# EAGLE design Enclosure 85x58 PBIU (EAGLE 9.6.1)
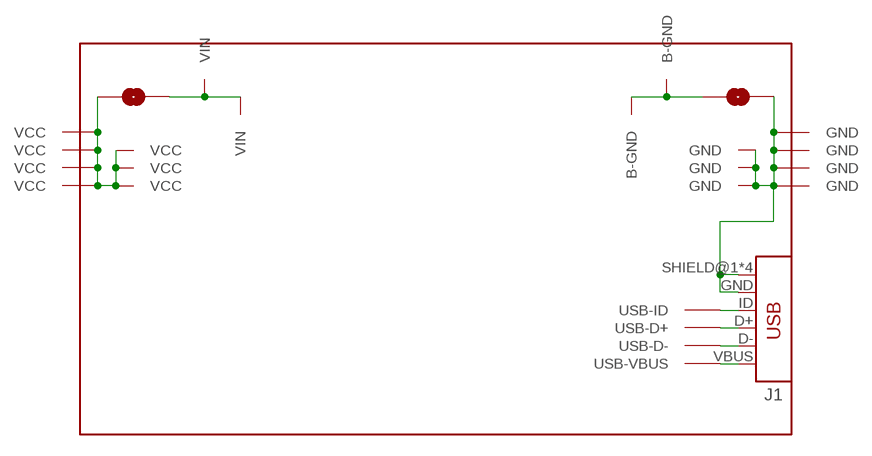
[diagram p0: schematic, sheet 1]

## Parts
J1  USB_MINI-B_SMT  [USB-MINIB]
U$1  PROTO-28X18-BAT-USB-SJ  [PROTO-28X18-BAT-USB-SJ]

## Nets
GND: J1.GND J1.SHIELD@1(SHIELD) J1.SHIELD@2(SHIELD) J1.SHIELD@3(SHIELD) J1.SHIELD@4(SHIELD) U$1.GND U$1.P27-11(GND) U$1.P27-12(GND) U$1.P27-13(GND) U$1.P28-11(GND) U$1.P28-12(GND) U$1.P28-13(GND) U$1.P28-14(GND)
N$2: U$1.P02-14(VIN) U$1.P03-14(VIN) U$1.VIN
N$3: U$1.B-GND U$1.P25-14(B-GND) U$1.P27-14(B-GND)
N$5: J1.VBUS U$1.P25-04(USB-VBUS)
N$6: J1.D- U$1.P25-05(USB-D-)
N$7: J1.D+ U$1.P25-06(USB-D+)
N$8: J1.ID U$1.P25-07(USB-ID)
VCC: U$1.P01-11(VCC) U$1.P01-12(VCC) U$1.P01-13(VCC) U$1.P01-14(VCC) U$1.P02-11(VCC) U$1.P02-12(VCC) U$1.P02-13(VCC) U$1.VCC

## Library data of the parts
J1 = digitalconcepts:USB_MINI-B: USB Mini-B Connector Breaks out 5 pins, and includes shield pins if needed.
U$1 = digitalconcepts:PROTO-28X18-BAT-USB-SJ: 28 x 18 Prototyping board, with SJ between battery connections and GND/Vcc planes and coupled side connection points, to fit an 85 x 58 enclosure

## Board
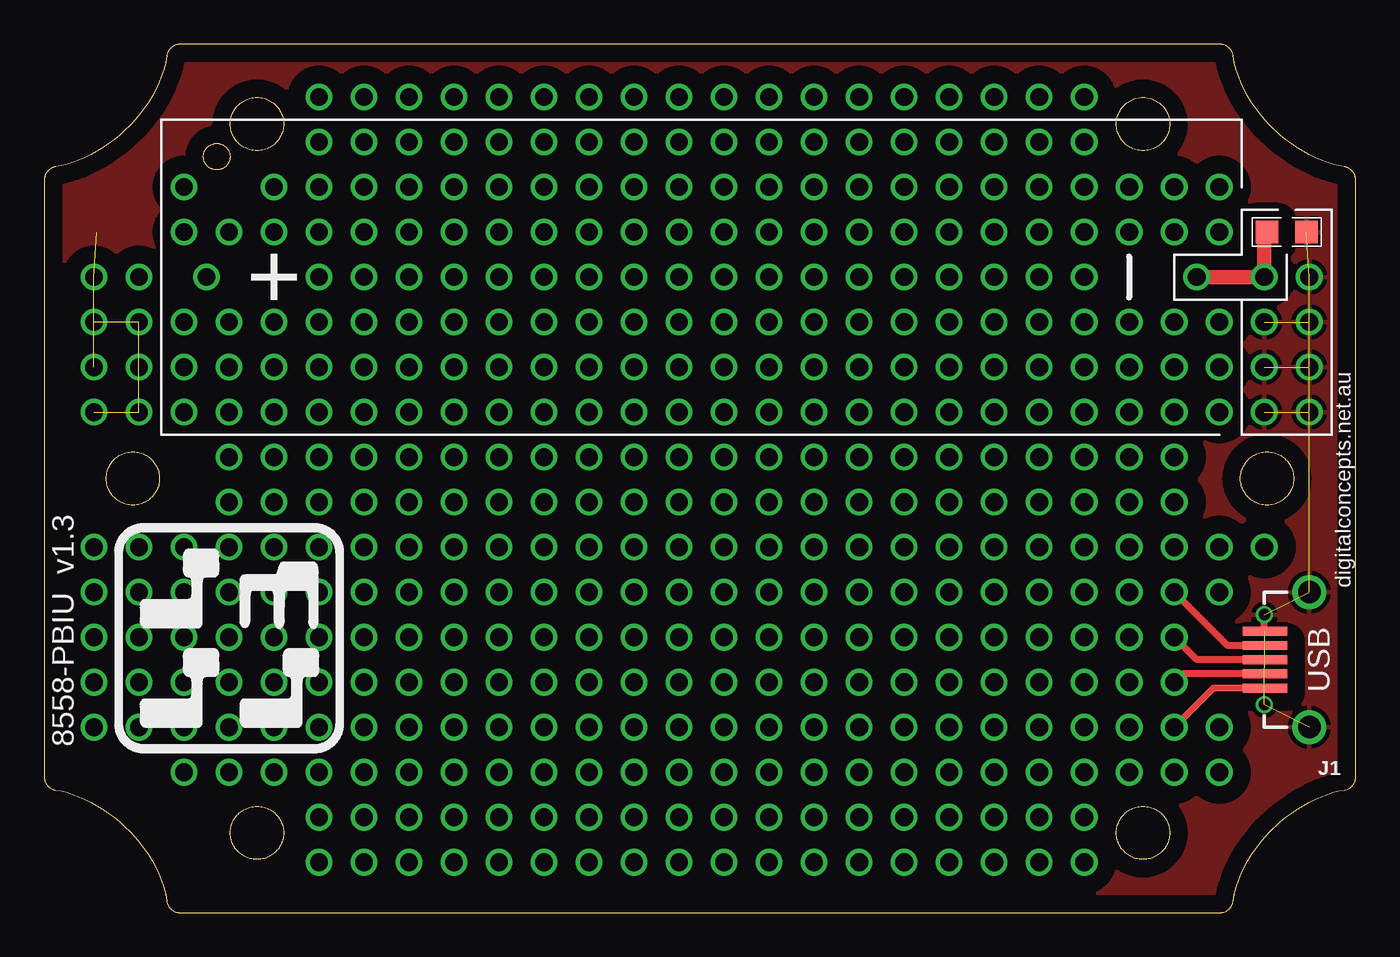
[diagram p1: board, top side]
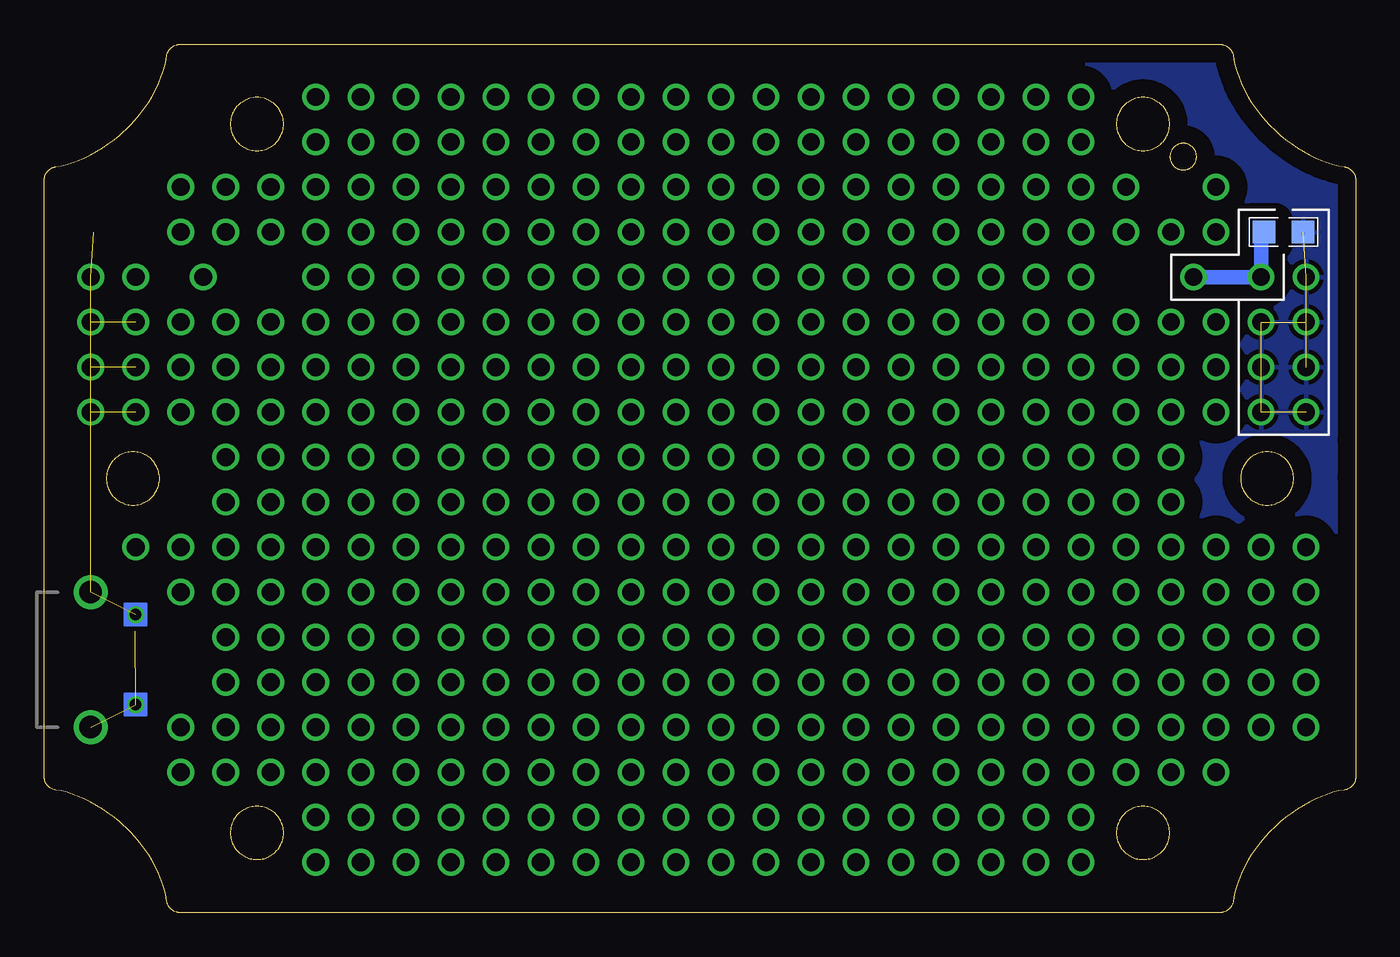
[diagram p2: board, bottom side, seen from below]

Size 74 x 49 mm. Coordinates in mm from the lower left corner, seen from the top.
Outline: 7.52,48.99 7.48,48.98 7.43,48.97 7.39,48.95 7.35,48.94 7.31,48.92 7.27,48.89 7.24,48.87 7.2,48.85 7.17,48.82 7.13,48.79 7.1,48.76 7.08,48.73 7.05,48.69 7.02,48.66 7,48.62 6.98,48.58 6.96,48.54 6.95,48.5 6.93,48.46 6.92,48.41 6.92,48.37 6.85,47.96 6.75,47.57 6.61,47.18 6.47,46.8 6.29,46.43 6.09,46.08 5.88,45.72 5.65,45.38 5.39,45.06 5.13,44.74 4.85,44.44 4.55,44.16 4.26,43.88 3.94,43.62 3.62,43.39 3.3,43.16 2.96,42.95 2.63,42.78 2.29,42.6 1.96,42.45 1.62,42.33 1.29,42.22 0.96,42.13 0.64,42.09 0.59,42.08 0.55,42.07 0.51,42.05 0.47,42.04 0.43,42.02 0.39,42 0.35,41.98 0.31,41.96 0.28,41.93 0.25,41.9 0.22,41.87 0.16,41.81 0.13,41.77 0.11,41.73 0.09,41.7 0.07,41.66 0.05,41.61 0.03,41.57 0.02,41.53 0.01,41.48 0,41.44 0,41.39 0,41.34 0,41.33 0,26.66 0,24.57 0,7.61 0,7.56 0.01,7.52 0.02,7.47 0.03,7.43 0.05,7.39 0.07,7.34 0.09,7.31 0.11,7.27 0.13,7.23 0.16,7.19 0.19,7.16 0.22,7.13 0.25,7.1 0.28,7.07 0.31,7.04 0.35,7.02 0.43,6.98 0.47,6.96 0.51,6.95 0.55,6.93 0.59,6.92 0.64,6.91 0.96,6.87 1.29,6.78 1.62,6.67 1.96,6.55 2.29,6.4 2.63,6.22 2.96,6.05 3.3,5.84 3.62,5.61 3.94,5.38 4.26,5.12 4.55,4.84 4.85,4.56 5.13,4.26 5.39,3.94 5.65,3.62 5.88,3.28 6.09,2.92 6.29,2.57 6.47,2.2 6.61,1.82 6.75,1.43 6.85,1.04 6.92,0.63 6.92,0.59 6.93,0.54 6.95,0.5 6.96,0.46 6.98,0.42 7,0.38 7.02,0.34 7.05,0.31 7.08,0.28 7.1,0.24 7.13,0.21 7.17,0.18 7.2,0.15 7.24,0.13 7.27,0.11 7.31,0.08 7.35,0.06 7.39,0.05 7.43,0.03 7.48,0.02 7.52,0.01 7.56,0 7.61,0 66.39,0 66.43,0 66.48,0.01 66.52,0.02 66.57,0.03 66.65,0.06 66.69,0.08 66.73,0.11 66.76,0.13 66.8,0.15 66.87,0.21 66.9,0.24 66.92,0.28 66.95,0.31 66.98,0.34 67.02,0.42 67.04,0.46 67.05,0.5 67.07,0.54 67.08,0.59 67.08,0.63 67.14,1.04 67.25,1.43 67.39,1.82 67.53,2.2 67.71,2.57 67.91,2.92 68.12,3.28 68.35,3.62 68.61,3.94 68.87,4.26 69.15,4.56 69.74,5.12 70.06,5.38 70.38,5.61 70.7,5.84 71.03,6.05 71.37,6.22 71.71,6.4 72.04,6.55 72.38,6.67 72.71,6.78 73.04,6.87 73.36,6.91 73.41,6.92 73.45,6.93 73.53,6.96 73.57,6.98 73.65,7.02 73.68,7.04 73.72,7.07 73.75,7.1 73.78,7.13 73.81,7.16 73.84,7.19 73.87,7.23 73.89,7.27 73.91,7.31 73.93,7.34 73.95,7.39 73.97,7.43 73.98,7.47 73.99,7.52 73.99,7.56 74,7.61 74,14.51 74,16.35 74,24.49 74,26.59 74,41.39 74,41.44 73.99,41.48 73.98,41.53 73.97,41.57 73.95,41.61 73.93,41.66 73.91,41.7 73.89,41.73 73.87,41.77 73.84,41.81 73.81,41.84 73.78,41.87 73.75,41.9 73.72,41.93 73.69,41.96 73.65,41.98 73.61,42 73.57,42.02 73.53,42.04 73.49,42.05 73.45,42.07 73.41,42.08 73.36,42.09 73.04,42.13 72.71,42.22 72.38,42.33 72.04,42.45 71.71,42.6 71.37,42.78 71.04,42.95 70.7,43.16 70.38,43.39 70.06,43.62 69.74,43.88 69.15,44.44 68.87,44.74 68.61,45.06 68.35,45.38 68.12,45.72 67.91,46.08 67.71,46.43 67.53,46.8 67.39,47.18 67.25,47.57 67.15,47.96 67.08,48.37 67.08,48.41 67.07,48.46 67.05,48.5 67.04,48.54 67.02,48.58 67,48.62 66.98,48.66 66.95,48.69 66.92,48.73 66.9,48.76 66.87,48.79 66.8,48.85 66.76,48.87 66.73,48.89 66.69,48.92 66.65,48.94 66.57,48.97 66.52,48.98 66.48,48.99 66.44,49 66.39,49 7.61,49 7.56,49 7.52,48.99
Outline: 62.3,5.97 62.4,5.95 62.49,5.92 62.58,5.88 62.67,5.84 62.76,5.8 62.84,5.74 62.92,5.69 62.99,5.63 63.13,5.49 63.19,5.42 63.24,5.34 63.3,5.26 63.34,5.17 63.38,5.08 63.42,4.99 63.45,4.9 63.47,4.8 63.49,4.71 63.5,4.6 63.5,4.4 63.49,4.3 63.47,4.2 63.45,4.1 63.42,4.01 63.38,3.92 63.34,3.83 63.3,3.74 63.24,3.66 63.19,3.58 63.13,3.51 62.99,3.37 62.92,3.31 62.84,3.26 62.76,3.2 62.67,3.16 62.58,3.12 62.49,3.08 62.4,3.05 62.3,3.03 62.2,3.01 62.1,3 61.9,3 61.8,3.01 61.7,3.03 61.6,3.05 61.51,3.08 61.42,3.12 61.33,3.16 61.24,3.2 61.08,3.31 61.01,3.37 60.87,3.51 60.81,3.58 60.76,3.66 60.7,3.74 60.66,3.83 60.62,3.92 60.58,4.01 60.55,4.1 60.53,4.2 60.51,4.3 60.5,4.4 60.5,4.6 60.51,4.71 60.53,4.8 60.55,4.9 60.58,4.99 60.62,5.08 60.66,5.17 60.7,5.26 60.76,5.34 60.81,5.42 60.87,5.49 61.01,5.63 61.08,5.69 61.16,5.74 61.24,5.8 61.33,5.84 61.42,5.88 61.51,5.92 61.6,5.95 61.7,5.97 61.8,5.99 61.9,6 62.1,6 62.2,5.99 62.3,5.97
Outline: 12.3,5.97 12.4,5.95 12.49,5.92 12.58,5.88 12.67,5.84 12.76,5.8 12.84,5.74 12.92,5.69 12.99,5.63 13.06,5.56 13.13,5.49 13.19,5.42 13.24,5.34 13.3,5.26 13.34,5.17 13.38,5.08 13.42,4.99 13.45,4.9 13.47,4.8 13.49,4.71 13.5,4.6 13.5,4.4 13.49,4.3 13.47,4.2 13.45,4.1 13.42,4.01 13.38,3.92 13.34,3.83 13.3,3.74 13.24,3.66 13.19,3.58 13.13,3.51 13.06,3.44 12.99,3.37 12.92,3.31 12.84,3.26 12.76,3.2 12.67,3.16 12.58,3.12 12.49,3.08 12.4,3.05 12.3,3.03 12.2,3.01 12.1,3 11.9,3 11.8,3.01 11.7,3.03 11.6,3.05 11.51,3.08 11.33,3.16 11.24,3.2 11.08,3.31 11.01,3.37 10.94,3.44 10.87,3.51 10.81,3.58 10.76,3.66 10.7,3.74 10.66,3.83 10.62,3.92 10.58,4.01 10.55,4.1 10.53,4.2 10.51,4.3 10.5,4.4 10.5,4.6 10.51,4.71 10.53,4.8 10.55,4.9 10.58,4.99 10.62,5.08 10.66,5.17 10.7,5.26 10.76,5.34 10.81,5.42 10.87,5.49 10.94,5.56 11.01,5.63 11.08,5.69 11.16,5.74 11.24,5.8 11.33,5.84 11.51,5.92 11.6,5.95 11.7,5.97 11.8,5.99 11.9,6 12.1,6 12.2,5.99 12.3,5.97
Outline: 4.7,23.03 4.6,23.05 4.51,23.08 4.42,23.12 4.33,23.16 4.24,23.2 4.16,23.26 4.08,23.31 4.01,23.37 3.94,23.44 3.87,23.51 3.81,23.58 3.76,23.66 3.7,23.74 3.66,23.83 3.62,23.92 3.58,24.01 3.55,24.1 3.53,24.2 3.51,24.3 3.5,24.4 3.5,24.6 3.51,24.7 3.53,24.8 3.55,24.9 3.58,24.99 3.62,25.08 3.66,25.17 3.7,25.26 3.76,25.34 3.81,25.42 3.87,25.49 4.01,25.63 4.08,25.69 4.16,25.74 4.24,25.8 4.33,25.84 4.42,25.88 4.51,25.92 4.6,25.95 4.7,25.97 4.79,25.99 4.9,26 5.1,26 5.2,25.99 5.3,25.97 5.4,25.95 5.49,25.92 5.58,25.88 5.67,25.84 5.76,25.8 5.84,25.74 5.92,25.69 5.99,25.63 6.13,25.49 6.19,25.42 6.24,25.34 6.3,25.26 6.34,25.17 6.38,25.08 6.42,24.99 6.45,24.9 6.47,24.8 6.49,24.7 6.5,24.6 6.5,24.4 6.49,24.3 6.47,24.2 6.45,24.1 6.42,24.01 6.38,23.92 6.34,23.83 6.3,23.74 6.24,23.66 6.19,23.58 6.13,23.51 6.06,23.44 5.99,23.37 5.92,23.31 5.84,23.26 5.76,23.2 5.67,23.16 5.58,23.12 5.49,23.08 5.4,23.05 5.3,23.03 5.2,23.01 5.1,23 4.9,23 4.79,23.01 4.7,23.03
Outline: 69.3,25.97 69.4,25.95 69.49,25.92 69.58,25.88 69.67,25.84 69.76,25.8 69.84,25.74 69.92,25.69 69.99,25.63 70.06,25.56 70.13,25.49 70.19,25.42 70.24,25.34 70.3,25.26 70.34,25.17 70.38,25.08 70.42,24.99 70.45,24.9 70.47,24.8 70.49,24.7 70.5,24.6 70.5,24.4 70.49,24.3 70.47,24.2 70.45,24.1 70.42,24.01 70.38,23.92 70.34,23.83 70.3,23.74 70.24,23.66 70.19,23.58 70.13,23.51 70.06,23.44 69.99,23.37 69.92,23.31 69.84,23.26 69.76,23.2 69.67,23.16 69.58,23.12 69.49,23.08 69.4,23.05 69.3,23.03 69.2,23.01 69.1,23 68.9,23 68.79,23.01 68.7,23.03 68.6,23.05 68.51,23.08 68.42,23.12 68.33,23.16 68.24,23.2 68.16,23.26 68.08,23.31 68.01,23.37 67.94,23.44 67.87,23.51 67.81,23.58 67.76,23.66 67.7,23.74 67.66,23.83 67.62,23.92 67.58,24.01 67.55,24.1 67.53,24.2 67.51,24.3 67.5,24.4 67.5,24.6 67.51,24.7 67.53,24.8 67.55,24.9 67.58,24.99 67.62,25.08 67.66,25.17 67.7,25.26 67.76,25.34 67.81,25.42 67.87,25.49 68.01,25.63 68.08,25.69 68.16,25.74 68.24,25.8 68.33,25.84 68.42,25.88 68.51,25.92 68.6,25.95 68.7,25.97 68.79,25.99 68.9,26 69.1,26 69.2,25.99 69.3,25.97
Outline: 10.46,42.81 10.47,42.76 10.48,42.71 10.48,42.61 10.47,42.56 10.46,42.51 10.45,42.46 10.44,42.41 10.42,42.37 10.4,42.32 10.38,42.28 10.35,42.24 10.32,42.2 10.29,42.16 10.26,42.13 10.23,42.1 10.19,42.07 10.15,42.04 10.11,42.01 10.07,41.99 10.02,41.97 9.98,41.95 9.93,41.94 9.88,41.93 9.83,41.92 9.78,41.91 9.68,41.91 9.63,41.92 9.58,41.93 9.53,41.94 9.48,41.95 9.44,41.97 9.39,41.99 9.35,42.01 9.31,42.04 9.27,42.07 9.23,42.1 9.2,42.13 9.17,42.16 9.13,42.2 9.11,42.24 9.08,42.28 9.06,42.32 9.04,42.37 9.02,42.41 9.01,42.46 9,42.51 8.99,42.56 8.98,42.61 8.98,42.71 8.99,42.76 9,42.81 9.01,42.86 9.02,42.91 9.04,42.95 9.06,43 9.08,43.04 9.11,43.08 9.13,43.12 9.17,43.16 9.2,43.19 9.23,43.22 9.27,43.25 9.31,43.28 9.35,43.31 9.39,43.33 9.44,43.35 9.48,43.37 9.53,43.39 9.58,43.4 9.63,43.41 9.68,43.41 9.78,43.41 9.83,43.41 9.88,43.4 9.93,43.39 9.98,43.37 10.02,43.35 10.07,43.33 10.11,43.31 10.15,43.28 10.19,43.25 10.23,43.22 10.26,43.19 10.29,43.16 10.32,43.12 10.35,43.08 10.38,43.04 10.4,43 10.42,42.95 10.44,42.91 10.45,42.86 10.46,42.81
Outline: 62.4,45.95 62.49,45.92 62.58,45.88 62.67,45.84 62.76,45.8 62.84,45.74 62.92,45.69 62.99,45.63 63.06,45.56 63.13,45.49 63.19,45.42 63.24,45.34 63.3,45.26 63.34,45.17 63.38,45.08 63.42,44.99 63.45,44.9 63.47,44.8 63.49,44.7 63.5,44.6 63.5,44.4 63.49,44.3 63.47,44.2 63.45,44.1 63.42,44.01 63.38,43.92 63.34,43.83 63.3,43.74 63.24,43.66 63.19,43.58 63.13,43.51 63.06,43.44 62.99,43.37 62.92,43.31 62.84,43.26 62.76,43.2 62.67,43.16 62.58,43.12 62.49,43.08 62.4,43.05 62.3,43.03 62.2,43.01 62.1,43 61.9,43 61.8,43.01 61.7,43.03 61.6,43.05 61.51,43.08 61.42,43.12 61.33,43.16 61.24,43.2 61.16,43.26 61.08,43.31 61.01,43.37 60.87,43.51 60.81,43.58 60.76,43.66 60.7,43.74 60.66,43.83 60.62,43.92 60.58,44.01 60.55,44.1 60.53,44.2 60.51,44.3 60.5,44.4 60.5,44.6 60.51,44.7 60.53,44.8 60.55,44.9 60.58,44.99 60.62,45.08 60.66,45.17 60.7,45.26 60.76,45.34 60.81,45.42 60.87,45.49 61.01,45.63 61.08,45.69 61.16,45.74 61.24,45.8 61.33,45.84 61.42,45.88 61.51,45.92 61.6,45.95 61.8,45.99 61.9,46 62.1,46 62.2,45.99 62.4,45.95
Outline: 12.3,45.97 12.4,45.95 12.49,45.92 12.58,45.88 12.67,45.84 12.76,45.8 12.84,45.74 12.92,45.69 12.99,45.63 13.06,45.56 13.13,45.49 13.19,45.42 13.24,45.34 13.3,45.26 13.34,45.17 13.38,45.08 13.42,44.99 13.45,44.9 13.47,44.8 13.49,44.7 13.5,44.6 13.5,44.4 13.49,44.3 13.47,44.2 13.45,44.1 13.42,44.01 13.38,43.92 13.34,43.83 13.3,43.74 13.24,43.66 13.19,43.58 13.13,43.51 13.06,43.44 12.99,43.37 12.92,43.31 12.84,43.26 12.76,43.2 12.67,43.16 12.58,43.12 12.49,43.08 12.4,43.05 12.3,43.03 12.2,43.01 12.1,43 11.9,43 11.8,43.01 11.7,43.03 11.6,43.05 11.51,43.08 11.33,43.16 11.24,43.2 11.16,43.26 11.08,43.31 11.01,43.37 10.94,43.44 10.87,43.51 10.81,43.58 10.76,43.66 10.7,43.74 10.66,43.83 10.62,43.92 10.58,44.01 10.55,44.1 10.53,44.2 10.51,44.3 10.5,44.4 10.5,44.6 10.51,44.7 10.53,44.8 10.55,44.9 10.58,44.99 10.62,45.08 10.66,45.17 10.7,45.26 10.76,45.34 10.81,45.42 10.87,45.49 10.94,45.56 11.01,45.63 11.08,45.69 11.16,45.74 11.24,45.8 11.33,45.84 11.51,45.92 11.6,45.95 11.7,45.97 11.8,45.99 11.9,46 12.1,46 12.2,45.99 12.3,45.97
Copper layers (1*16): Top 0.035mm / dielectric 1.5mm / Bottom 0.035mm
Design rules "default *": minimum track width 6mil, minimum drill 0.35mm, track to track 6mil, track to pad 6mil, pad to pad 6mil, via to via 6mil, smd to smd 6mil, copper to edge 40mil, drill to drill 6mil, minimum pad ring 1mil, minimum via ring 8mil, stop-mask expansion 4mil, vias tented up to drill 0mil, thermal gap 10mil

### Footprints (pad centres in the part's own frame; a part is rotated, then mirrored left to right if it is on the bottom)
USB-MINIB = smd 2.5 x 0.5: D+ 2.5,0; D- 2.5,0.8; GND 2.5,-1.6; ID 2.5,-0.8; VBUS 2.5,1.6 | drill 1.27: SHIELD@1 0,3.81; SHIELD@2 0,-3.81 | drill 0.65 pad 0.762: SHIELD@3 2.54,2.54; SHIELD@4 2.54,-2.54
PROTO-28X18-BAT-USB-SJ = smd 1.27 x 1.27: B-GND 31.914,13.97; GND 34.126,13.97 | drill 1: P01-04 -34.29,-13.97; P01-05 -34.29,-11.43; P01-06 -34.29,-8.89; P01-07 -34.29,-6.35; P01-08 -34.29,-3.81; P01-11 -34.29,3.81; P01-12 -34.29,6.35; P01-13 -34.29,8.89; P01-14 -34.29,11.43; P02-04 -31.75,-13.97; P02-05 -31.75,-11.43; P02-06 -31.75,-8.89; P02-07 -31.75,-6.35; P02-08 -31.75,-3.81; P02-11 -31.75,3.81; P02-12 -31.75,6.35; P02-13 -31.75,8.89; P02-14 -31.75,11.43; P03-03 -29.21,-16.51; P03-04 -29.21,-13.97; P03-05 -29.21,-11.43; P03-06 -29.21,-8.89; P03-07 -29.21,-6.35; P03-08 -29.21,-3.81; P03-11 -29.21,3.81; P03-12 -29.21,6.35; P03-13 -29.21,8.89; P03-14 -27.94,11.43; P03-15 -29.21,13.97; P03-16 -29.21,16.51; P04-03 -26.67,-16.51; P04-04 -26.67,-13.97; P04-05 -26.67,-11.43; P04-06 -26.67,-8.89; P04-07 -26.67,-6.35; P04-08 -26.67,-3.81; P04-09 -26.67,-1.27; P04-10 -26.67,1.27; P04-11 -26.67,3.81; P04-12 -26.67,6.35; P04-13 -26.67,8.89; P04-15 -26.67,13.97; P05-03 -24.13,-16.51; P05-04 -24.13,-13.97; P05-05 -24.13,-11.43; P05-06 -24.13,-8.89; P05-07 -24.13,-6.35; P05-08 -24.13,-3.81; P05-09 -24.13,-1.27; P05-10 -24.13,1.27; P05-11 -24.13,3.81; P05-12 -24.13,6.35; P05-13 -24.13,8.89; P05-15 -24.13,13.97; P05-16 -24.13,16.51; P06-01 -21.59,-21.59; P06-02 -21.59,-19.05; P06-03 -21.59,-16.51; P06-04 -21.59,-13.97; P06-05 -21.59,-11.43; P06-06 -21.59,-8.89; P06-07 -21.59,-6.35; P06-08 -21.59,-3.81; P06-09 -21.59,-1.27; P06-10 -21.59,1.27; P06-11 -21.59,3.81; P06-12 -21.59,6.35; P06-13 -21.59,8.89; P06-14 -21.59,11.43; P06-15 -21.59,13.97; P06-16 -21.59,16.51; P06-17 -21.59,19.05; P06-18 -21.59,21.59; P07-01 -19.05,-21.59; P07-02 -19.05,-19.05; P07-03 -19.05,-16.51; P07-04 -19.05,-13.97; P07-05 -19.05,-11.43; P07-06 -19.05,-8.89; P07-07 -19.05,-6.35; P07-08 -19.05,-3.81; P07-09 -19.05,-1.27; P07-10 -19.05,1.27; P07-11 -19.05,3.81; P07-12 -19.05,6.35; P07-13 -19.05,8.89; P07-14 -19.05,11.43; P07-15 -19.05,13.97; P07-16 -19.05,16.51; P07-17 -19.05,19.05; P07-18 -19.05,21.59; P08-01 -16.51,-21.59; P08-02 -16.51,-19.05; P08-03 -16.51,-16.51; P08-04 -16.51,-13.97; P08-05 -16.51,-11.43; P08-06 -16.51,-8.89; P08-07 -16.51,-6.35; P08-08 -16.51,-3.81; P08-09 -16.51,-1.27; P08-10 -16.51,1.27; P08-11 -16.51,3.81; P08-12 -16.51,6.35; P08-13 -16.51,8.89; P08-14 -16.51,11.43; P08-15 -16.51,13.97; P08-16 -16.51,16.51; P08-17 -16.51,19.05; P08-18 -16.51,21.59; P09-01 -13.97,-21.59; P09-02 -13.97,-19.05; P09-03 -13.97,-16.51; P09-04 -13.97,-13.97; P09-05 -13.97,-11.43; P09-06 -13.97,-8.89; P09-07 -13.97,-6.35; P09-08 -13.97,-3.81; P09-09 -13.97,-1.27; P09-10 -13.97,1.27; P09-11 -13.97,3.81; P09-12 -13.97,6.35; P09-13 -13.97,8.89; P09-14 -13.97,11.43; P09-15 -13.97,13.97; P09-16 -13.97,16.51; P09-17 -13.97,19.05; P09-18 -13.97,21.59; P10-01 -11.43,-21.59; P10-02 -11.43,-19.05; P10-03 -11.43,-16.51; P10-04 -11.43,-13.97; P10-05 -11.43,-11.43; P10-06 -11.43,-8.89; P10-07 -11.43,-6.35; P10-08 -11.43,-3.81; P10-09 -11.43,-1.27; P10-10 -11.43,1.27; P10-11 -11.43,3.81; P10-12 -11.43,6.35; P10-13 -11.43,8.89; P10-14 -11.43,11.43; P10-15 -11.43,13.97; P10-16 -11.43,16.51; P10-17 -11.43,19.05; P10-18 -11.43,21.59; P11-01 -8.89,-21.59; P11-02 -8.89,-19.05; P11-03 -8.89,-16.51; P11-04 -8.89,-13.97; P11-05 -8.89,-11.43; P11-06 -8.89,-8.89; P11-07 -8.89,-6.35; P11-08 -8.89,-3.81; P11-09 -8.89,-1.27; P11-10 -8.89,1.27; P11-11 -8.89,3.81; P11-12 -8.89,6.35; P11-13 -8.89,8.89; P11-14 -8.89,11.43; P11-15 -8.89,13.97; P11-16 -8.89,16.51; P11-17 -8.89,19.05; P11-18 -8.89,21.59; P12-01 -6.35,-21.59; P12-02 -6.35,-19.05; P12-03 -6.35,-16.51; P12-04 -6.35,-13.97; P12-05 -6.35,-11.43; P12-06 -6.35,-8.89; P12-07 -6.35,-6.35; P12-08 -6.35,-3.81; P12-09 -6.35,-1.27; P12-10 -6.35,1.27; P12-11 -6.35,3.81; P12-12 -6.35,6.35; P12-13 -6.35,8.89; P12-14 -6.35,11.43; P12-15 -6.35,13.97; P12-16 -6.35,16.51; P12-17 -6.35,19.05; P12-18 -6.35,21.59; P13-01 -3.81,-21.59; P13-02 -3.81,-19.05; P13-03 -3.81,-16.51; P13-04 -3.81,-13.97; P13-05 -3.81,-11.43; P13-06 -3.81,-8.89; P13-07 -3.81,-6.35; P13-08 -3.81,-3.81; P13-09 -3.81,-1.27; P13-10 -3.81,1.27; P13-11 -3.81,3.81; P13-12 -3.81,6.35; P13-13 -3.81,8.89; P13-14 -3.81,11.43; P13-15 -3.81,13.97; P13-16 -3.81,16.51; P13-17 -3.81,19.05; P13-18 -3.81,21.59; P14-01 -1.27,-21.59; P14-02 -1.27,-19.05; P14-03 -1.27,-16.51; P14-04 -1.27,-13.97; P14-05 -1.27,-11.43; P14-06 -1.27,-8.89; P14-07 -1.27,-6.35; P14-08 -1.27,-3.81; P14-09 -1.27,-1.27; P14-10 -1.27,1.27; P14-11 -1.27,3.81; P14-12 -1.27,6.35; P14-13 -1.27,8.89; P14-14 -1.27,11.43; P14-15 -1.27,13.97; P14-16 -1.27,16.51; P14-17 -1.27,19.05; P14-18 -1.27,21.59; P15-01 1.27,-21.59; P15-02 1.27,-19.05; P15-03 1.27,-16.51; P15-04 1.27,-13.97; P15-05 1.27,-11.43; P15-06 1.27,-8.89; P15-07 1.27,-6.35; P15-08 1.27,-3.81; P15-09 1.27,-1.27; P15-10 1.27,1.27; P15-11 1.27,3.81; P15-12 1.27,6.35; P15-13 1.27,8.89; P15-14 1.27,11.43; P15-15 1.27,13.97; P15-16 1.27,16.51; P15-17 1.27,19.05; P15-18 1.27,21.59; P16-01 3.81,-21.59; P16-02 3.81,-19.05; P16-03 3.81,-16.51; P16-04 3.81,-13.97; P16-05 3.81,-11.43; P16-06 3.81,-8.89; P16-07 3.81,-6.35; P16-08 3.81,-3.81; P16-09 3.81,-1.27; P16-10 3.81,1.27; P16-11 3.81,3.81; P16-12 3.81,6.35; P16-13 3.81,8.89; P16-14 3.81,11.43; P16-15 3.81,13.97; P16-16 3.81,16.51; P16-17 3.81,19.05; P16-18 3.81,21.59; P17-01 6.35,-21.59; P17-02 6.35,-19.05; P17-03 6.35,-16.51; P17-04 6.35,-13.97; P17-05 6.35,-11.43; P17-06 6.35,-8.89; P17-07 6.35,-6.35; P17-08 6.35,-3.81; P17-09 6.35,-1.27; P17-10 6.35,1.27; P17-11 6.35,3.81; P17-12 6.35,6.35; P17-13 6.35,8.89; P17-14 6.35,11.43; P17-15 6.35,13.97; P17-16 6.35,16.51; P17-17 6.35,19.05; P17-18 6.35,21.59; P18-01 8.89,-21.59; P18-02 8.89,-19.05; P18-03 8.89,-16.51; P18-04 8.89,-13.97; P18-05 8.89,-11.43; P18-06 8.89,-8.89; P18-07 8.89,-6.35; P18-08 8.89,-3.81; P18-09 8.89,-1.27; P18-10 8.89,1.27; P18-11 8.89,3.81; P18-12 8.89,6.35; P18-13 8.89,8.89; P18-14 8.89,11.43; P18-15 8.89,13.97; P18-16 8.89,16.51; P18-17 8.89,19.05; P18-18 8.89,21.59; P19-01 11.43,-21.59; P19-02 11.43,-19.05; P19-03 11.43,-16.51; P19-04 11.43,-13.97; P19-05 11.43,-11.43; P19-06 11.43,-8.89; P19-07 11.43,-6.35; P19-08 11.43,-3.81; P19-09 11.43,-1.27; P19-10 11.43,1.27; P19-11 11.43,3.81; P19-12 11.43,6.35; P19-13 11.43,8.89; P19-14 11.43,11.43; P19-15 11.43,13.97; P19-16 11.43,16.51; P19-17 11.43,19.05; P19-18 11.43,21.59; P20-01 13.97,-21.59; P20-02 13.97,-19.05; P20-03 13.97,-16.51; P20-04 13.97,-13.97; P20-05 13.97,-11.43; P20-06 13.97,-8.89; P20-07 13.97,-6.35; P20-08 13.97,-3.81; P20-09 13.97,-1.27; P20-10 13.97,1.27; P20-11 13.97,3.81; P20-12 13.97,6.35; P20-13 13.97,8.89; P20-14 13.97,11.43; P20-15 13.97,13.97; P20-16 13.97,16.51; P20-17 13.97,19.05; P20-18 13.97,21.59; P21-01 16.51,-21.59; P21-02 16.51,-19.05; P21-03 16.51,-16.51; P21-04 16.51,-13.97; P21-05 16.51,-11.43; P21-06 16.51,-8.89; P21-07 16.51,-6.35; P21-08 16.51,-3.81; P21-09 16.51,-1.27; P21-10 16.51,1.27; P21-11 16.51,3.81; P21-12 16.51,6.35; P21-13 16.51,8.89; P21-14 16.51,11.43; P21-15 16.51,13.97; P21-16 16.51,16.51; P21-17 16.51,19.05; P21-18 16.51,21.59; P22-01 19.05,-21.59; P22-02 19.05,-19.05; P22-03 19.05,-16.51; P22-04 19.05,-13.97; P22-05 19.05,-11.43; P22-06 19.05,-8.89; P22-07 19.05,-6.35; P22-08 19.05,-3.81; P22-09 19.05,-1.27; P22-10 19.05,1.27; P22-11 19.05,3.81; P22-12 19.05,6.35; P22-13 19.05,8.89; P22-14 19.05,11.43; P22-15 19.05,13.97; P22-16 19.05,16.51; P22-17 19.05,19.05; P22-18 19.05,21.59; P23-01 21.59,-21.59; P23-02 21.59,-19.05; P23-03 21.59,-16.51; P23-04 21.59,-13.97; P23-05 21.59,-11.43; P23-06 21.59,-8.89; P23-07 21.59,-6.35; P23-08 21.59,-3.81; P23-09 21.59,-1.27; P23-10 21.59,1.27; P23-11 21.59,3.81; P23-12 21.59,6.35; P23-13 21.59,8.89; P23-14 21.59,11.43; P23-15 21.59,13.97; P23-16 21.59,16.51; P23-17 21.59,19.05; P23-18 21.59,21.59; P24-03 24.13,-16.51; P24-04 24.13,-13.97; P24-05 24.13,-11.43; P24-06 24.13,-8.89; P24-07 24.13,-6.35; P24-08 24.13,-3.81; P24-09 24.13,-1.27; P24-10 24.13,1.27; P24-11 24.13,3.81; P24-12 24.13,6.35; P24-13 24.13,8.89; P24-15 24.13,13.97; P24-16 24.13,16.51; P25-03 26.67,-16.51; P25-04 26.67,-13.97; P25-05 26.67,-11.43; P25-06 26.67,-8.89; P25-07 26.67,-6.35; P25-08 26.67,-3.81; P25-09 26.67,-1.27; P25-10 26.67,1.27; P25-11 26.67,3.81; P25-12 26.67,6.35; P25-13 26.67,8.89; P25-14 27.94,11.43; P25-15 26.67,13.97; P25-16 26.67,16.51; P26-03 29.21,-16.51; P26-04 29.21,-13.97; P26-07 29.21,-6.35; P26-08 29.21,-3.81; P26-11 29.21,3.81; P26-12 29.21,6.35; P26-13 29.21,8.89; P26-15 29.21,13.97; P26-16 29.21,16.51; P27-08 31.75,-3.81; P27-11 31.75,3.81; P27-12 31.75,6.35; P27-13 31.75,8.89; P27-14 31.75,11.43; P28-11 34.29,3.81; P28-12 34.29,6.35; P28-13 34.29,8.89; P28-14 34.29,11.43 | smd 1.27 x 1.27 bottom: VCC -34.126,13.97; VIN -31.914,13.97

### Placement (x,y rotation side)
J1  71.38,14.27 180 top
U$1  37.09,24.43 0 top

### Tracks (layer width: path | path; a pad name or v marks a point on that pad's centre or on a via)
GND  (11 unrouted)
  Top 0.152: J1.GND 68.84,15.91
  Top 0.406: 68.84,15.91 J1.SHIELD@4
  pour Top (isolate 1.016): -1.26,50.34 75.19,50.34 75.19,-1.48 -1.26,-1.48
N$2
  Bottom 0.813: U$1.P03-14 U$1.P02-14 5.34,38.24 U$1.VIN
N$3
  Top 0.152: 68.84,38.24 U$1.B-GND
  Top 0.813: U$1.P25-14 U$1.P27-14 68.84,38.24
N$5
  Top 0.406: J1.VBUS 65.97,12.67 U$1.P25-04
N$6
  Top 0.406: J1.D- 64.23,13.47 U$1.P25-05
N$7
  Top 0.406: J1.D+ 65.03,14.27 U$1.P25-06
N$8
  Top 0.406: J1.ID 66.77,15.07 U$1.P25-07
VCC  (7 unrouted)
  pour Bottom (isolate 1.016): 0.01,49.07 73.92,49.07 73.92,-0.21 0.01,-0.21

### Text on the board
tPlace: + | digitalconcepts.net.au | 8558-PBIU v1.3 | USB